# EAGLE design sfg_adapter (EAGLE 7.5.0)
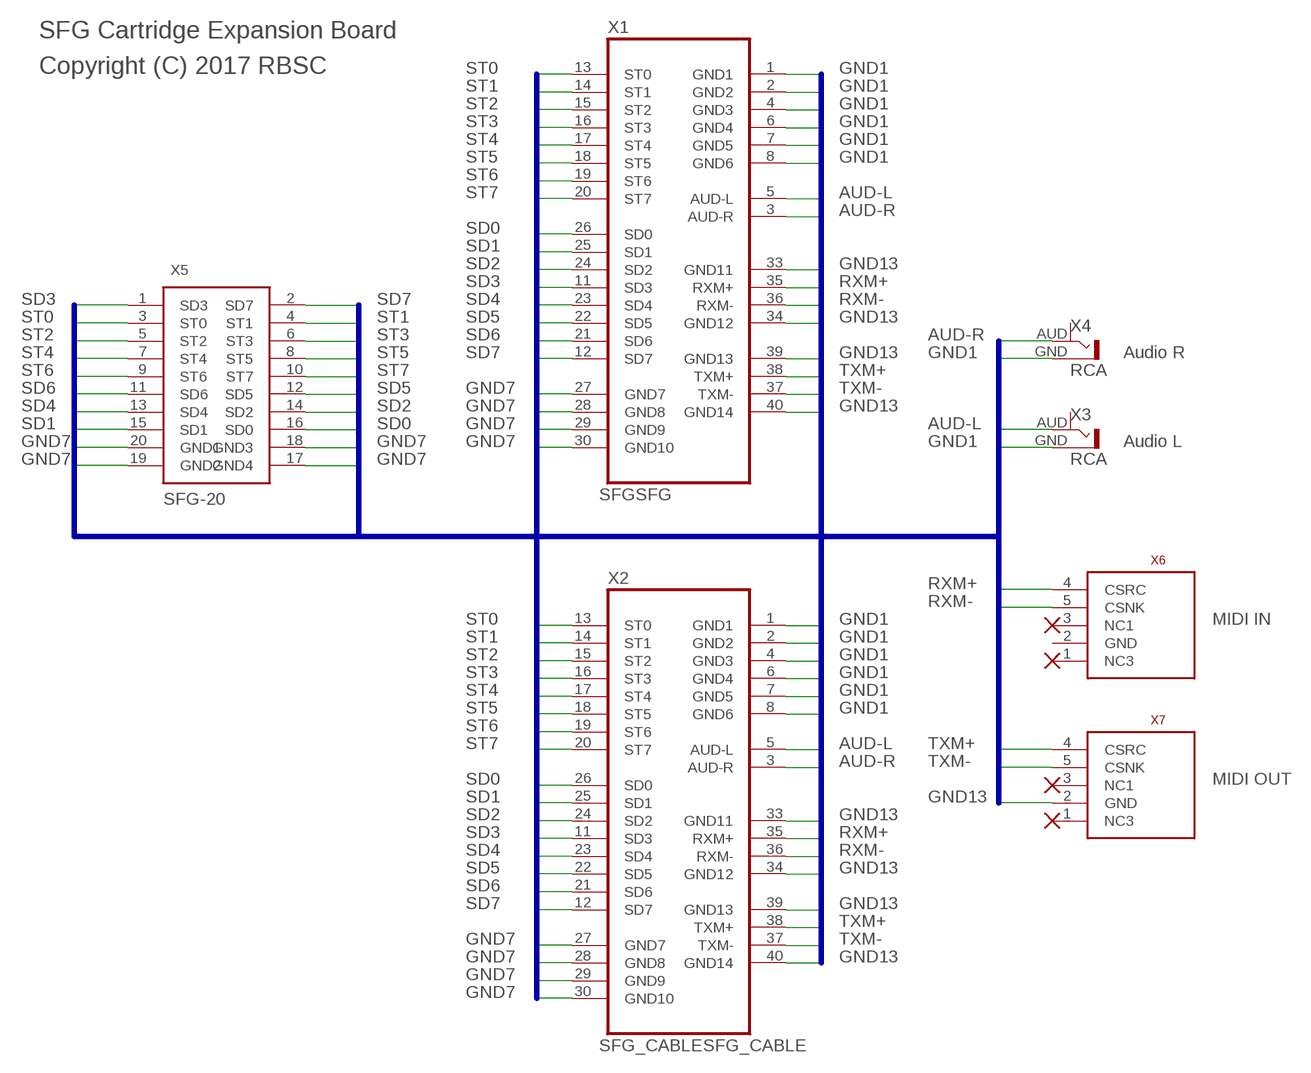
[diagram p0: schematic, sheet 1]

## Parts
X1  SFGSFG  [SFG]
X2  SFG_CABLESFG_CABLE  [SFG_CABLE]
X3  RCA  [RCA]
X4  RCA  [RCA]
X5  SFG-20  [SFG-20]
X6  MIDI_CONN_FEMALE_SUPPORT  [DIN_5_FEMALE_SUPPORT]
X7  MIDI_CONN_FEMALE_SUPPORT  [DIN_5_FEMALE_SUPPORT]

## Nets
AUD-L: X1.5(AUD-L) X2.5(AUD-L) X3.AUD
AUD-R: X1.3(AUD-R) X2.3(AUD-R) X4.AUD
GND1: X1.1(GND1) X1.2(GND2) X1.4(GND3) X1.6(GND4) X1.7(GND5) X1.8(GND6) X2.1(GND1) X2.2(GND2) X2.4(GND3) X2.6(GND4) X2.7(GND5) X2.8(GND6) X3.GND(GND1) X4.GND(GND1)
GND7: X1.27(GND7) X1.28(GND8) X1.29(GND9) X1.30(GND10) X2.27(GND7) X2.28(GND8) X2.29(GND9) X2.30(GND10) X5.17(GND4) X5.18(GND3) X5.19(GND2) X5.20(GND1)
GND13: X1.33(GND11) X1.34(GND12) X1.39(GND13) X1.40(GND14) X2.33(GND11) X2.34(GND12) X2.39(GND13) X2.40(GND14) X7.2(GND)
RXM+: X1.35(RXM+) X2.35(RXM+) X6.4(CSRC)
RXM-: X1.36(RXM-) X2.36(RXM-) X6.5(CSNK)
SD0: X1.26(SD0) X2.26(SD0) X5.16(SD0)
SD1: X1.25(SD1) X2.25(SD1) X5.15(SD1)
SD2: X1.24(SD2) X2.24(SD2) X5.14(SD2)
SD3: X1.11(SD3) X2.11(SD3) X5.1(SD3)
SD4: X1.23(SD4) X2.23(SD4) X5.13(SD4)
SD5: X1.22(SD5) X2.22(SD5) X5.12(SD5)
SD6: X1.21(SD6) X2.21(SD6) X5.11(SD6)
SD7: X1.12(SD7) X2.12(SD7) X5.2(SD7)
ST0: X1.13(ST0) X2.13(ST0) X5.3(ST0)
ST1: X1.14(ST1) X2.14(ST1) X5.4(ST1)
ST2: X1.15(ST2) X2.15(ST2) X5.5(ST2)
ST3: X1.16(ST3) X2.16(ST3) X5.6(ST3)
ST4: X1.17(ST4) X2.17(ST4) X5.7(ST4)
ST5: X1.18(ST5) X2.18(ST5) X5.8(ST5)
ST6: X1.19(ST6) X2.19(ST6) X5.9(ST6)
ST7: X1.20(ST7) X2.20(ST7) X5.10(ST7)
TXM+: X1.38(TXM+) X2.38(TXM+) X7.4(CSRC)
TXM-: X1.37(TXM-) X2.37(TXM-) X7.5(CSNK)
Unconnected: X3.AUD1 X4.AUD1 X6.1(NC3) X6.2(GND) X6.3(NC1) X7.1(NC3) X7.3(NC1)

## Buses
ST0,ST1,ST2,ST3,ST4,ST5,ST6,ST7,SD0,SD1,SD2,SD3,SD4,SD5,SD6,SD7,GND1,GDN2,GND3,GND4,GND5,GND6,GND7,GND8,GND9,GND10,GND11,GND12,GND13,GND14,RXM+,RXM-,TXM+,TXM-,AUD-L,AUD-R

## Notes on the sheet
- SFG Cartridge Expansion Board
- Copyright (C) 2017 RBSC
- Audio R
- Audio L
- MIDI IN
- MIDI OUT

## Library data of the parts
X1 = sfg_connector:SFG: SFG CONNECTOR
X2 = sfg_connector_cable:SFG_CABLE: SFG CONNECTOR
X3 X4 = rca:RCA: RCA connector Cinch
X5 = sfg-20:SFG-20: 20-pin connector for keyboards
X6 X7 = SparkFun-Connectors:MIDI_CONN_FEMALE_SUPPORT: MIDI connector with strain relief (DIN-5 female)

## Board
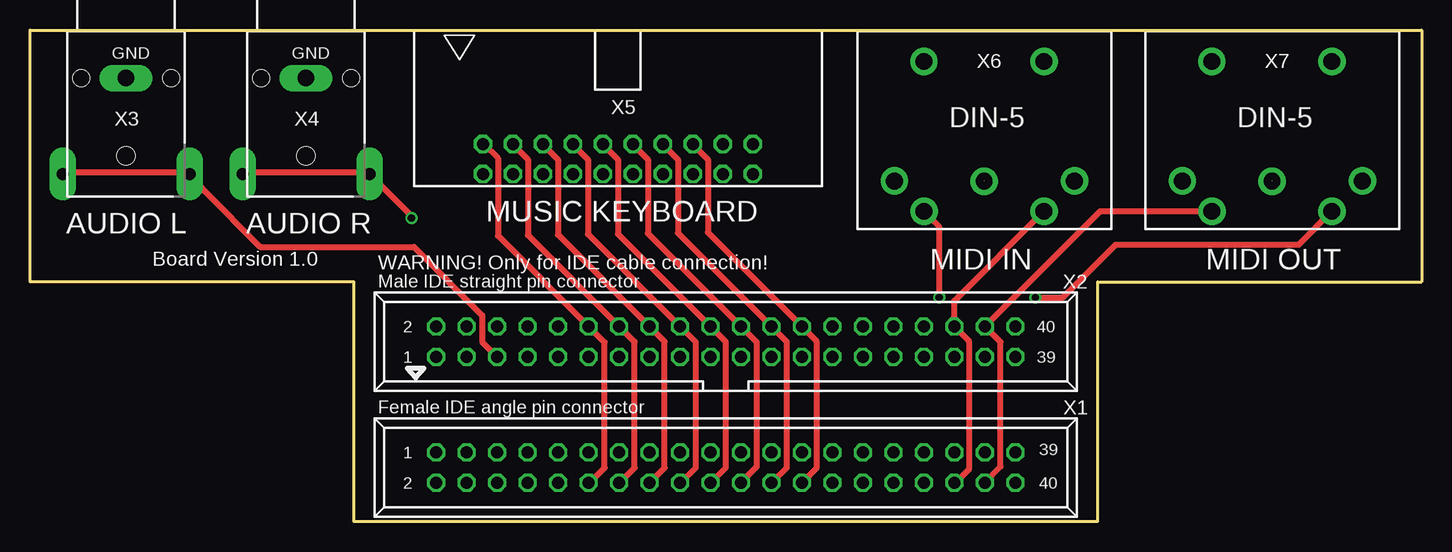
[diagram p1: board, top side]
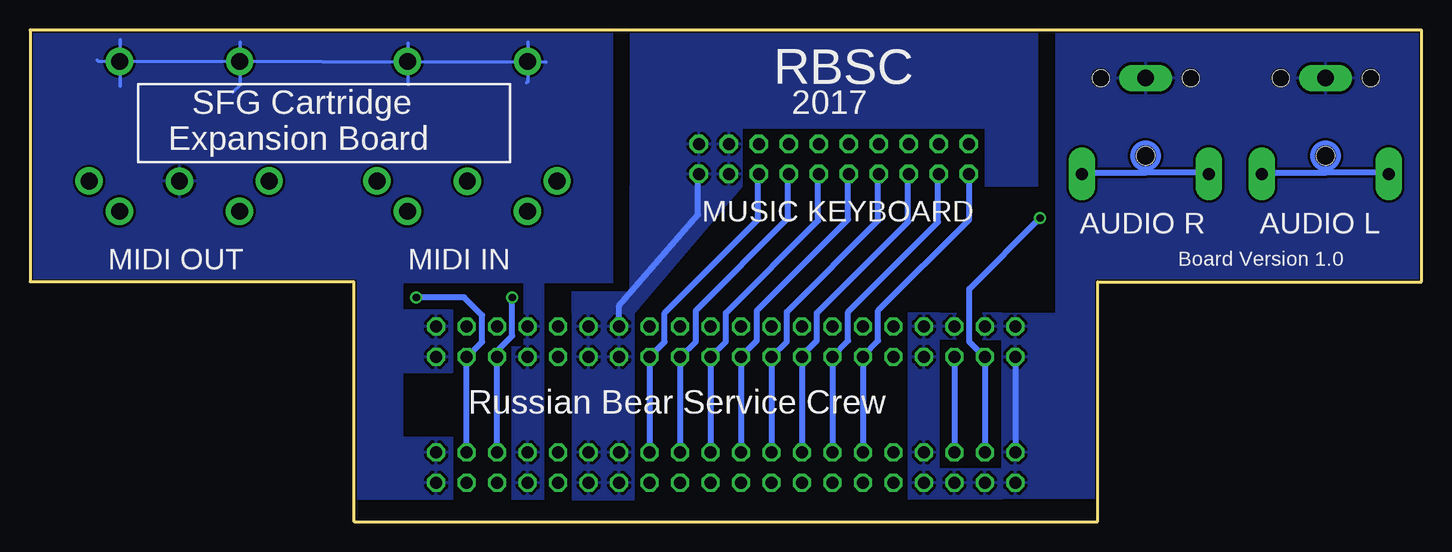
[diagram p2: board, bottom side, seen from below]

Size 116 x 41 mm. Coordinates in mm from the lower left corner, seen from the top.
Outline: 89,0 27,0 27,20 0,20 0,41 116,41 116,20 89,20 89,0
Copper layers (1*16): Top 0.035mm / dielectric 1.5mm / Bottom 0.035mm
Design rules "default *": minimum track width 10mil, minimum drill 24mil, track to track 8mil, track to pad 8mil, pad to pad 8mil, via to via 8mil, smd to smd 8mil, copper to edge 4mil, drill to drill 8mil, minimum pad ring 10mil, minimum via ring 8mil, stop-mask expansion 4mil, vias tented up to drill 24mil, thermal gap 10mil

### Footprints (pad centres in the part's own frame; a part is rotated, then mirrored left to right if it is on the bottom)
SFG = drill 1 octagon: 1 -24.13,1.27; 2 -24.13,-1.27; 3 -21.59,1.27; 4 -21.59,-1.27; 5 -19.05,1.27; 6 -19.05,-1.27; 7 -16.51,1.27; 8 -16.51,-1.27; 9 -13.97,1.27; 10 -13.97,-1.27; 11 -11.43,1.27; 12 -11.43,-1.27; 13 -8.89,1.27; 14 -8.89,-1.27; 15 -6.35,1.27; 16 -6.35,-1.27; 17 -3.81,1.27; 18 -3.81,-1.27; 19 -1.27,1.27; 20 -1.27,-1.27; 21 1.27,1.27; 22 1.27,-1.27; 23 3.81,1.27; 24 3.81,-1.27; 25 6.35,1.27; 26 6.35,-1.27; 27 8.89,1.27; 28 8.89,-1.27; 29 11.43,1.27; 30 11.43,-1.27; 31 13.97,1.27; 32 13.97,-1.27; 33 16.51,1.27; 34 16.51,-1.27; 35 19.05,1.27; 36 19.05,-1.27; 37 21.59,1.27; 38 21.59,-1.27; 39 24.13,1.27; 40 24.13,-1.27
SFG_CABLE = drill 1 octagon: 1 -24.13,-1.27; 2 -24.13,1.27; 3 -21.59,-1.27; 4 -21.59,1.27; 5 -19.05,-1.27; 6 -19.05,1.27; 7 -16.51,-1.27; 8 -16.51,1.27; 9 -13.97,-1.27; 10 -13.97,1.27; 11 -11.43,-1.27; 12 -11.43,1.27; 13 -8.89,-1.27; 14 -8.89,1.27; 15 -6.35,-1.27; 16 -6.35,1.27; 17 -3.81,-1.27; 18 -3.81,1.27; 19 -1.27,-1.27; 20 -1.27,1.27; 21 1.27,-1.27; 22 1.27,1.27; 23 3.81,-1.27; 24 3.81,1.27; 25 6.35,-1.27; 26 6.35,1.27; 27 8.89,-1.27; 28 8.89,1.27; 29 11.43,-1.27; 30 11.43,1.27; 31 13.97,-1.27; 32 13.97,1.27; 33 16.51,-1.27; 34 16.51,1.27; 35 19.05,-1.27; 36 19.05,1.27; 37 21.59,-1.27; 38 21.59,1.27; 39 24.13,-1.27; 40 24.13,1.27
RCA = drill 1 pad 2.2 long: AUD 5.3,-12; AUD1 -5.283,-12 | drill 1.4 pad 2.2 long: GND 0,-4 | hole 1.4: -3.75,-4; 3.75,-4 | hole 1.5: 0,-10.5
SFG-20 = drill 1 octagon: 1 5.75,1; 2 5.75,3.5; 3 8.25,1; 4 8.25,3.5; 5 10.75,1; 6 10.75,3.5; 7 13.25,1; 8 13.25,3.5; 9 15.75,1; 10 15.75,3.5; 11 18.25,1; 12 18.25,3.5; 13 20.75,1; 14 20.75,3.5; 15 23.25,1; 16 23.25,3.5; 17 25.75,1; 18 25.75,3.5; 19 28.25,1; 20 28.25,3.5
DIN_5_FEMALE_SUPPORT = drill 1.4 pad 2.286: 1 7.94,3.6; 2 0.46,3.61; 3 -7.07,3.6; 4 5.47,6.13; 5 -4.53,6.12; 6 -4.53,-6.382; 7 5.478,-6.382

### Placement (x,y rotation side)
X1  58,4.5 0 top
X2  58,15 0 top
X3  8,41 0 top
X4  23,41 0 top
X5  32,28 0 top
X6  80,32 180 top
X7  104,32 180 top

### Tracks (layer width: path | path; a pad name or v marks a point on that pad's centre or on a via)
AUD-L
  Top 0.5: X3.AUD 14.5,27.6 19.2,22.9 32,22.9 37.7,17.2 37.7,14.98 X2.5
  Bottom 0.5: X2.5 X1.5
AUD-R  (via drill 0.6)
  Top 0.5: v31.8,25.3 31.8,25.5 X4.AUD
  Bottom 0.5: X1.3 X2.3 36.43,13.73 37.7,15 37.7,19.4 v31.8,25.3
GND1
  Bottom 0.5: X2.1 X1.1
  pour Bottom: 0,41 0,20 30.5,20 30.5,41
  pour Bottom: 27,20 27,1.9 35,1.9 35,17.4 30.5,17.4 30.5,20
  pour Bottom: 35,4.4 40.2,4.4 40.2,17.4 42.8,17.4 42.8,1.9 35,1.9
  pour Bottom: 35,17.4 36.6,17.4 36.6,15.2 35,15.2
  pour Bottom: 40.2,17.4 38.8,17.4 38.8,15.2 40.2,15.2
GND7
  Bottom 0.5: X2.28 66.89,18.01 60.3,25.6 60.3,28.95 X5.19
  pour Bottom: 56.6,32.8 36.4,32.8 36.4,28 32,28 32,41 66,41 66,28 56.6,28
  pour Bottom: 70.8,17.4 70.8,1.8 65.6,1.8 65.6,17.4
  pour Bottom: 70.8,17.4 70.8,19.2 66,19.2 66,28 56.6,28 65.6,17.4
GND13
  Bottom 0.3: 73,38.3 110.3,38.4 110.4,38.5 | 74.5,40 74.5,36.7 74.6,36.6 | 84.5,39.9 84.5,36.5 84.4,36.5 | 98.5,40 98.5,36.4 99.1,35.8 | 108.5,40.2 108.5,36.3
  pour Bottom: 67.5,41 116,41 116,20.5 116,20 67.5,20 67.5,40.5
  pour Bottom: 80.8,17.6 80.8,12.5 89,12.5 89,20 85,20 85,17.6
  pour Bottom: 85,12.5 85,7 80.8,7 80.8,1.9 89,1.9 89,12.5
  pour Bottom: 73.2,20 73.2,1.8 75.8,1.8 75.8,14.6 74.8,14.6 74.8,20
N$1
  Bottom 0.5: 13.3,29.1 8,29.1 | 2.7,29.1 8,29.1 | 8,29.1 8,29.4
N$2
  Bottom 0.5: 28.3,29.1 23,29.1 | 17.7,29.1 23,29.1 | 23,29.1 23,29.4
N$3
  Top 0.5: 28.4,29.1 17.8,29.1
N$4
  Top 0.5: 13.3,29.1 2.7,29.1
RXM+  (via drill 0.6)
  Top 0.5: v75.8,18.7 75.8,24.6 X6.4
  Bottom 0.5: X1.35 X2.35 77.05,14.25 75.8,15.5 v75.8,18.7
RXM-
  Top 0.5: X1.36 77.13,3.23 78.3,4.4 78.3,15.02 X2.36 77.05,18.4 X6.5
SD0
  Top 0.5: X1.26 64.35,3.25 65.6,4.5 65.6,15.02 X2.26 56.5,24.12 56.5,30.2 55.25,31.45 X5.16
SD1
  Bottom 0.5: X1.25 X2.25 64.35,13.75 63.1,15 63.1,17.4 55.3,25.2 55.3,28.95 X5.15
SD2
  Top 0.5: X1.24 61.83,3.23 63.1,4.5 63.1,14.98 X2.24 54,24.08 54,30.2 52.75,31.45 X5.14
SD3
  Bottom 0.5: X1.11 X2.11 46.57,13.83 45.3,15.1 45.3,17.6 37.7,25.2 37.7,28.95 X5.1
SD4
  Bottom 0.5: X1.23 X2.23 61.77,13.73 60.5,15 60.5,17.6 52.8,25.3 52.8,28.95 X5.13
SD5
  Top 0.5: X1.22 59.27,3.27 60.6,4.6 60.6,14.94 X2.22 51.5,24.04 51.5,30.2 50.25,31.45 X5.12
SD6
  Bottom 0.5: X1.21 X2.21 58,15 58,17.4 50.3,25.1 50.3,28.95 X5.11
SD7
  Top 0.5: X1.12 46.63,3.23 47.9,4.5 47.9,14.94 X2.12 39,23.84 39,30.3 37.8,31.5 X5.2
ST0
  Bottom 0.5: X1.13 X2.13 49.11,13.79 47.8,15.1 47.8,17.5 40.3,25 40.3,28.95 X5.3
ST1
  Top 0.5: X1.14 49.13,3.23 50.4,4.5 50.4,14.98 X2.14 41.5,23.88 41.5,30.2 40.25,31.45 X5.4
ST2
  Bottom 0.5: X1.15 X2.15 51.65,13.85 50.4,15.1 50.4,17.4 42.8,25 42.8,28.95 X5.5
ST3
  Top 0.5: X1.16 51.65,3.25 52.9,4.5 52.9,15.02 X2.16 44,23.92 44,30.2 42.75,31.45 X5.6
ST4
  Bottom 0.5: X1.17 X2.17 54.17,13.73 52.9,15 52.9,17.5 45.3,25.1 45.3,28.95 X5.7
ST5
  Top 0.5: X1.18 54.23,3.23 55.5,4.5 55.5,14.96 X2.18 46.5,23.96 46.5,30.2 45.25,31.45 X5.8
ST6
  Bottom 0.5: X1.19 X2.19 56.73,13.77 55.4,15.1 55.4,17.6 47.8,25.2 47.8,28.95 X5.9
ST7
  Top 0.5: X1.20 58,4.5 58,15 X2.20 49,24 49,30.2 47.75,31.45 X5.10
TXM+
  Top 0.5: X1.38 79.59,3.29 80.9,4.6 80.9,14.96 X2.38 89.19,25.87 X7.4
TXM-  (via drill 0.6)
  Top 0.5: v83.8,18.7 86.1,18.7 90.5,23.1 105.75,23.1 X7.5
  Bottom 0.5: X1.37 X2.37 79.57,13.73 78.3,15 78.3,17.2 79.8,18.7 v83.8,18.7
(copper drawn outside any net)
  shapes: Bottom circle x2

### Text on the board
tNames: GND | GND | X6 | X7 | MUSIC KEYBOARD | AUDIO L | AUDIO R | Board Version 1.0 | WARNING! Only for IDE cable connection! | MIDI IN | MIDI OUT | Male IDE straight pin connector | Female IDE angle pin connector
bNames: RBSC | 2017 | SFG Cartridge | Expansion Board | MUSIC KEYBOARD | AUDIO L | AUDIO R | Board Version 1.0 | MIDI IN | MIDI OUT | Russian Bear Service Crew